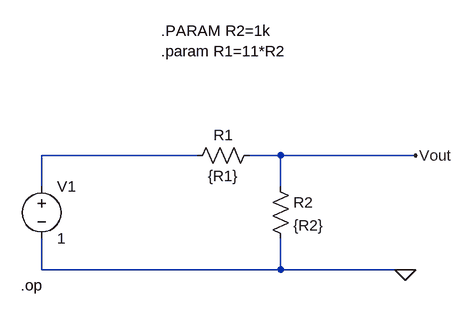
[diagram p0: schematic Draft1.asc]
Draft1.asc, the LTspice schematic file:
Version 4.1
SHEET 1 880 680
WIRE 144 144 -96 144
WIRE 272 144 224 144
WIRE 480 144 272 144
WIRE -96 192 -96 144
WIRE 272 192 272 144
WIRE -96 320 -96 272
WIRE 272 320 272 272
WIRE 272 320 -96 320
WIRE 464 320 272 320
WIRE 480 320 464 320
FLAG 480 144 Vout
FLAG 464 320 0
DATAFLAG 448 144 ""
SYMBOL res 240 128 R90
WINDOW 0 0 56 VBottom 2
WINDOW 3 32 56 VTop 2
SYMATTR InstName R1
SYMATTR Value {R1}
SYMBOL res 256 176 R0
SYMATTR InstName R2
SYMATTR Value {R2}
SYMBOL voltage -96 176 R0
WINDOW 123 0 0 Left 0
WINDOW 39 0 0 Left 0
SYMATTR InstName V1
SYMATTR Value 1
TEXT -128 344 Left 2 !.op
TEXT 88 -48 Left 2 !.PARAM R2=1k\n.param R1=11*R2

The netlist it stands for:
* Draft1.asc
R1 Vout N001 {R1}
R2 Vout 0 {R2}
V1 N001 0 1
.op
.PARAM R2=1k
.param R1=11*R2
.backanno
.end